# EAGLE schematic ch32v307_feather v6 (EAGLE 9.7.0)
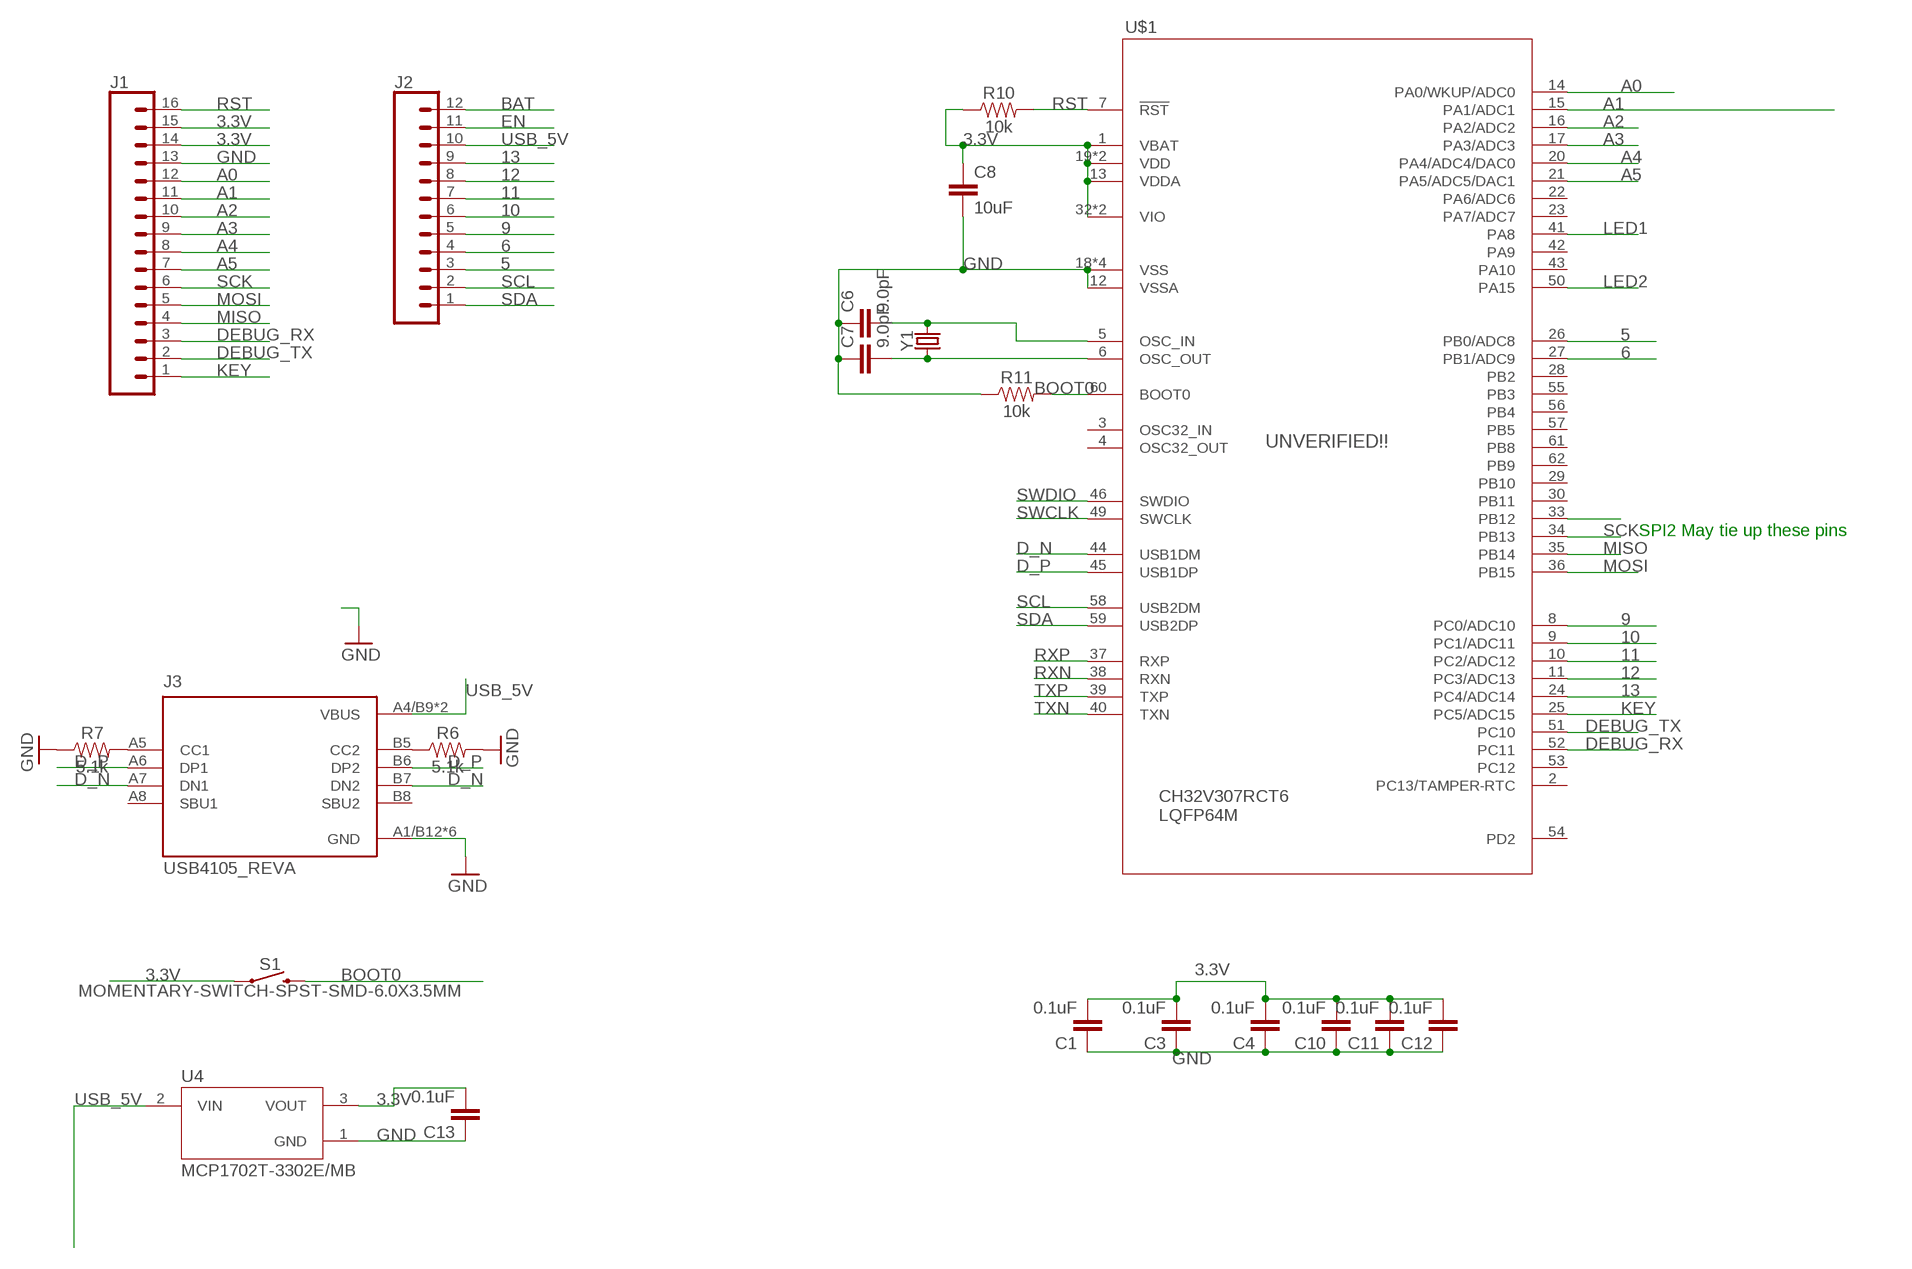
[diagram p0: schematic, sheet 1]

## Parts
C1  0.1uF  CAP0603-CAP  [0603-CAP]
C3  0.1uF  CAP0603-CAP  [0603-CAP]
C4  0.1uF  CAP0603-CAP  [0603-CAP]
C6  9.0pF  9.0PF-0603-50V-10%  [0603]
C7  9.0pF  9.0PF-0603-50V-10%  [0603]
C8  10uF  10UF-1210-50V-20%  [1210]
C10  0.1uF  CAP0603-CAP  [0603-CAP]
C11  0.1uF  CAP0603-CAP  [0603-CAP]
C12  0.1uF  CAP0603-CAP  [0603-CAP]
C13  0.1uF  CAP0603-CAP  [0603-CAP]
J1  CONN_16  [1X16]
J2  CONN_12  [1X12]
J3  USB4105_REVA  [GCT_USB4105_REVA]
R6  5.1k  RESISTOR0603  [0603]
R7  5.1k  RESISTOR0603  [0603]
R10  10k  10KOHM-0603-1/10W-1%  [0603]
R11  10k  10KOHM-0603-1/10W-1%  [0603]
S1  MOMENTARY-SWITCH-SPST-SMD-6.0X3.5MM  [TACTILE_SWITCH_SMD_6.0X3.5MM]
U4  MCP1702T-3302E/MB  [REG_MCP1702T-3302E/MB]
U$1  CH32V307RCT6  [LQFP64M]
Y1  CRYSTALSMD-3.2X2.5  [CRYSTAL-SMD-3.2X2.5MM]

## Nets
3.3V [PWR]: C1.2 C3.2 C4.2 C8.1 C10.2 C11.2 C12.2 C13.2 J1.14 J1.15 R10.1 S1.1 U4.3(VOUT) U$1.1(VBAT) U$1.13(VDDA) U$1.19(VDD) U$1.32(VIO) U$1.48(VDD) U$1.64(VIO)
5: J2.3 U$1.26(PB0/ADC8)
6: J2.4 U$1.27(PB1/ADC9)
9: J2.5 U$1.8(PC0/ADC10)
10: J2.6 U$1.9(PC1/ADC11)
11: J2.7 U$1.10(PC2/ADC12)
12: J2.8 U$1.11(PC3/ADC13)
13: J2.9 U$1.24(PC4/ADC14)
A0: J1.12 U$1.14(PA0/WKUP/ADC0)
A1: J1.11 U$1.15(PA1/ADC1)
A2: J1.10 U$1.16(PA2/ADC2)
A3: J1.9 U$1.17(PA3/ADC3)
A4: J1.8 U$1.20(PA4/ADC4/DAC0)
A5: J1.7 U$1.21(PA5/ADC5/DAC1)
BAT: J2.12
BOOT0: R11.2 S1.2 U$1.60(BOOT0)
D_N: J3.A7(DN1) J3.B7(DN2) U$1.44(USB1DM)
D_P: J3.A6(DP1) J3.B6(DP2) U$1.45(USB1DP)
DEBUG_RX: J1.3 U$1.52(PC11)
DEBUG_TX: J1.2 U$1.51(PC10)
EN: J2.11
GND [power]: C1.1 C3.1 C4.1 C6.1 C7.1 C8.2 C10.1 C11.1 C12.1 C13.1 J1.13 J3.A1/B12(GND) J3.B1/A12(GND) J3.G1(GND) J3.G2(GND) J3.G3(GND) J3.G4(GND) R6.2 R7.1 R11.1 U4.1(GND) U$1.12(VSSA) U$1.18(VSS) U$1.31(VSS) U$1.47(VSS) U$1.63(VSS)
KEY: J1.1 U$1.25(PC5/ADC15)
LED1: U$1.41(PA8)
LED2: U$1.50(PA15)
MISO: J1.4 U$1.35(PB14)
MOSI: J1.5 U$1.36(PB15)
N$1: C6.2 U$1.5(OSC_IN) Y1.3
N$3: C7.2 U$1.6(OSC_OUT) Y1.1
N$4: U$1.33(PB12)
N$6: J3.B5(CC2) R6.1
N$7: J3.A5(CC1) R7.2
RST: J1.16 R10.2 U$1.7(!RST)
RXN: U$1.38(RXN)
RXP: U$1.37(RXP)
SCK: J1.6 U$1.34(PB13)
SCL: J2.2 U$1.58(USB2DM)
SDA: J2.1 U$1.59(USB2DP)
SWCLK: U$1.49(SWCLK)
SWDIO: U$1.46(SWDIO)
TXN: U$1.40(TXN)
TXP: U$1.39(TXP)
USB_5V: J2.10 J3.A4/B9(VBUS) J3.B4/A9(VBUS) U4.2(VIN)
Unconnected: J3.A8(SBU1) J3.B8(SBU2) U$1.2(PC13/TAMPER-RTC) U$1.3(OSC32_IN) U$1.4(OSC32_OUT) U$1.22(PA6/ADC6) U$1.23(PA7/ADC7) U$1.28(PB2) U$1.29(PB10) U$1.30(PB11) U$1.42(PA9) U$1.43(PA10) U$1.53(PC12) U$1.54(PD2) U$1.55(PB3) U$1.56(PB4) U$1.57(PB5) U$1.61(PB8) U$1.62(PB9)

## Notes on the sheet
- SPI2 May tie up these pins

## Library data of the parts
C1 C3 C4 C10-C13 = SparkFun-Capacitors:CAP: Capacitor Standard 0603 ceramic capacitor, and 0.1" leaded capacitor.
C6 C7 = SparkFun-Capacitors:9.0PF: 9.0pF ceramic capacitors A capacitor is a passive two-terminal electrical component used to store electrical energy temporarily in an electric field.; PROD_ID: CAP-09341
C8 = SparkFun-Capacitors:10UF: 10.0µF ceramic capacitors A capacitor is a passive two-terminal electrical component used to store electrical energy temporarily in an electric field.; PROD_ID: CAP-09824
J1 = SparkFun-Connectors:CONN_16: Multi connection point. Often used as Generic Header-pin footprint for 0.1 inch spaced/style header connections On any of the 0.1 inch spaced packages, you can populate with these: Break Away Headers - Straight <https://www.sparkfun.com/products/116> (PRT-00116) Break Away Male Headers - Right Angle <https://www.sparkfun.com/products/553> (PRT-00553) Female Headers <https://www.sparkfun.com/products/115> (PRT-00115) Break Away Headers - Machine Pin <https://www.sparkfun.com/products/117> (PRT-00117) Break Away Female Headers - Swiss Machine Pin <https://www.sparkfun.com/products/743> (PRT-00743) For SCREWTERMINALS and SPRING TERMINALS visit here: Screw Terimnals on SparkFun.com <https://www.sparkfun.com/search/results?term=Screw+Terminals> (5mm/3.5mm/2.54mm spacing) This device is also useful as a general connection point to wire up your design to another part of your project. Our various solder wires solder well into these plated through hole pads. Hook-Up Wire - Assortment (Stranded, 22 AWG) <https://www.sparkfun.com/products/11375> (PRT-11375) Hook-Up Wire - Assortment (Solid Core, 22 AWG) <https://www.sparkfun.com/products/11367> (PRT-11367) View the entire wire category on our website here <https://www.sparkfun.com/categories/141> Special notes: Molex polarized connector foot print use with SKU : PRT-08231 with associated crimp pins and housings. 1MM SMD Version SKU: PRT-10208 NOTES ON THE VARIANTS LOCK and LOCK_LONGPADS... This footprint was designed to help hold the alignment of a through-hole component (i.e. 6-pin header) while soldering it into place. You may notice that each hole has been shifted either up or down by 0.005 of an inch from it's more standard position (which is a perfectly straight line). This slight alteration caused the pins (the squares in the middle) to touch the edges of the holes. Because they are alternating, it causes a "brace" to hold the component in place. 0.005 has proven to be the perfect amount of "off-center" position when using our standard breakaway headers. Although looks a little odd when you look at the bare footprint, once you have a header in there, the alteration is very hard to notice. Also,if you push a header all the way into place, it is covered up entirely on the bottom side.
J2 = SparkFun-Connectors:CONN_12: Multi connection point. Often used as Generic Header-pin footprint for 0.1 inch spaced/style header connections On any of the 0.1 inch spaced packages, you can populate with these: Break Away Headers - Straight <https://www.sparkfun.com/products/116> (PRT-00116) Break Away Male Headers - Right Angle <https://www.sparkfun.com/products/553> (PRT-00553) Female Headers <https://www.sparkfun.com/products/115> (PRT-00115) Break Away Headers - Machine Pin <https://www.sparkfun.com/products/117> (PRT-00117) Break Away Female Headers - Swiss Machine Pin <https://www.sparkfun.com/products/743> (PRT-00743) For SCREWTERMINALS and SPRING TERMINALS visit here: Screw Terimnals on SparkFun.com <https://www.sparkfun.com/search/results?term=Screw+Terminals> (5mm/3.5mm/2.54mm spacing) This device is also useful as a general connection point to wire up your design to another part of your project. Our various solder wires solder well into these plated through hole pads. Hook-Up Wire - Assortment (Stranded, 22 AWG) <https://www.sparkfun.com/products/11375> (PRT-11375) Hook-Up Wire - Assortment (Solid Core, 22 AWG) <https://www.sparkfun.com/products/11367> (PRT-11367) View the entire wire category on our website here <https://www.sparkfun.com/categories/141> Special notes: Molex polarized connector foot print use with SKU : PRT-08231 with associated crimp pins and housings. 1MM SMD Version SKU: PRT-10208 NOTES ON THE VARIANTS LOCK and LOCK_LONGPADS... This footprint was designed to help hold the alignment of a through-hole component (i.e. 6-pin header) while soldering it into place. You may notice that each hole has been shifted either up or down by 0.005 of an inch from it's more standard position (which is a perfectly straight line). This slight alteration caused the pins (the squares in the middle) to touch the edges of the holes. Because they are alternating, it causes a "brace" to hold the component in place. 0.005 has proven to be the perfect amount of "off-center" position when using our standard breakaway headers. Although looks a little odd when you look at the bare footprint, once you have a header in there, the alteration is very hard to notice. Also,if you push a header all the way into place, it is covered up entirely on the bottom side.
J3 = USB4105_REVA:USB4105_REVA: USB Type C Receptacle for USB 2.0 SMT Type, PCB Top Mount; MANUFACTURER: GCT; MAXIMUM_PACKAGE_HEIGHT: 3.31 mm; PARTREV: 0.2; STANDARD: Manufacturer Recommendations
R6 R7 = SparkFun-Resistors:RESISTOR: Generic Resistor Package
R10 R11 = SparkFun-Resistors:10KOHM: 10kΩ resistor A resistor is a passive two-terminal electrical component that implements electrical resistance as a circuit element. Resistors act to reduce current flow, and, at the same time, act to lower voltage levels within circuits. - Wikipedia; PROD_ID: RES-00824
S1 = SparkFun-Switches:MOMENTARY-SWITCH-SPST: Momentary Switch (Pushbutton) - SPST Normally-open (NO) SPST momentary switches (buttons, pushbuttons). Variants PTH-12MM - 12mm square, through-hole Momentary Pushbutton Switch - 12mm Square <https://www.sparkfun.com/products/9190> (COM-09190) PTH-6.0MM, PTH-6.0MM-KIT - 6.0mm square, through-hole Mini Pushbutton Switch <https://www.sparkfun.com/products/97> (COM-00097) KIT package intended for soldering kit's - only one side of pads' copper is exposed. PTH-RIGHT-ANGLE-KIT - Right-angle, through-hole Right Angle Tactile Button <https://www.sparkfun.com/products/10791> - Used on SparkFun BigTime Watch Kit <https://www.sparkfun.com/products/11734> SMD-12MM - 12mm square, surface-mount Tactile Button - SMD (12mm) <https://www.sparkfun.com/products/12993> (COM-12993) Used on SparkFun PicoBoard <https://www.sparkfun.com/products/11888> SMD-4.5MM - 4.5mm Square Trackball Switch Used on SparkFun Blackberry Trackballer Breakout <https://www.sparkfun.com/products/13169> SMD-4.6MMX2.8MM - 4.60mm x 2.80mm, surface mount Used on SparkFun SAMD21 Mini Breakout <https://www.sparkfun.com/products/13664> SMD-5.2MM, SMD-5.2-REDUNDANT - 5.2mm square, surface-mount Mini Pushbutton Switch - SMD <https://www.sparkfun.com/products/8720> (COM-08720) Used on Arduino Pro Mini <https://www.sparkfun.com/products/11114> REDUNDANT package connects both switch circuits together SMD-6.0X3.5MM - 6.0 x 3.5mm, surface mount Momentary Reset Switch SMD <https://www.sparkfun.com/products/8229> (COM-08229) SMD-6.2MM-TALL - 6.2mm square, surface mount Tactile Button - SMD (6mm) <https://www.sparkfun.com/products/12992> Used on SparkFun Digital Sandbox <https://www.sparkfun.com/products/12651> SMD-RIGHT-ANGLE - Right-angle, surface mount Used on SparkFun Block for Intel® Edison - Arduino <https://www.sparkfun.com/products/13036>; PROD_ID: SWCH-00815; SF_SKU: COM-08229
U4 = MCP1702T-3302E_MB:MCP1702T-3302E/MB: MCP1702 Series 250 mA 3.3 V Fixed Output Surface Mount LDO Regulator - SOT-89; MANUFACTURER: Microchip; MAXIMUM_PACKAGE_HEIGHT: 1.6mm; PARTREV: E; STANDARD: Manufacturer recommendations
U$1 = wch32v307:CH32V307RCT6
Y1 = SparkFun-Clocks:CRYSTAL: Crystals (Generic) These are passive quartz crystals, which can be used as a clock source for a microcontroller. Crystal's are two-terminal devices. They require external "load" capacitors to generate an oscillating signal.

## Net classes
1 power: width 0.178 mm
3 PWR: width 0.406 mm